# Altium schematic sheet Schematic.SchDoc
size A4
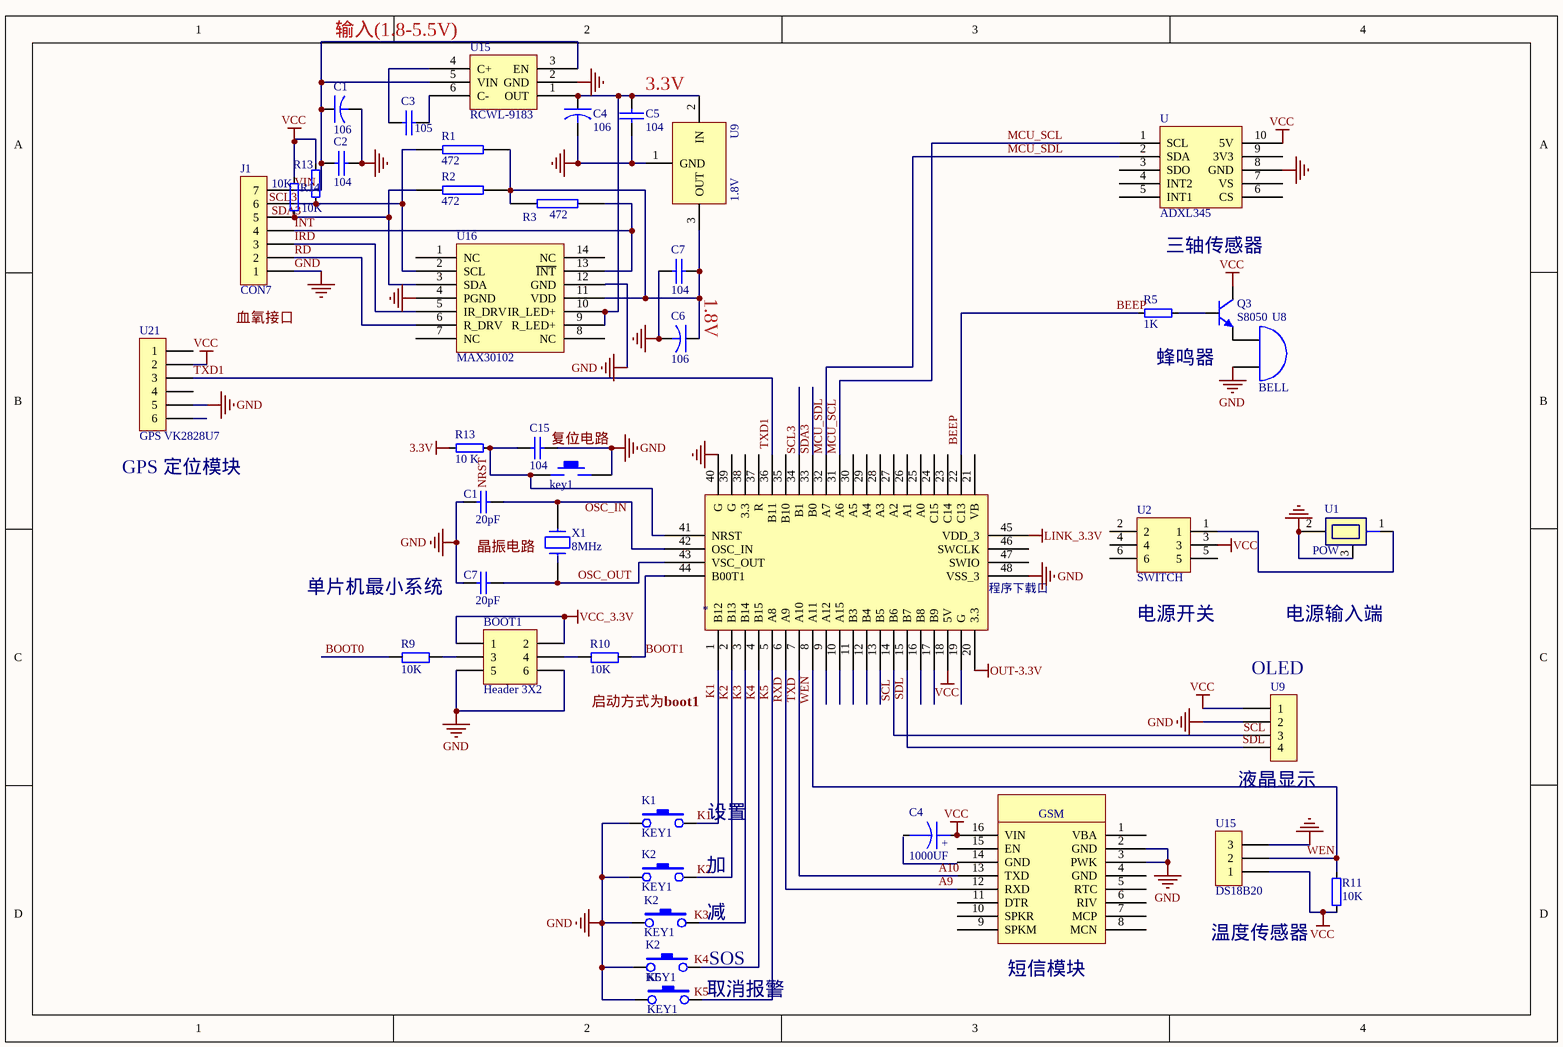
[diagram p0: Schematic.SchDoc]

## Parts
(Parts that share a designator on the sheet are numbered #1, #2 ... from top to bottom, then left to right.)
*  程序下载口
?  (no value)
BOOT1  Header 3X2  [排针2X3]
C1#1  106
C1#2  20pF  [0603C]
C2  104
C3  105
C4#1  106
C4#2  1000UF  [C10]
C5  104
C6  106
C7#1  104
C7#2  20pF  [0603C]
C15  104  [0603C]
J1  CON7
K1  KEY1  [KEY1]
K2#1  KEY1  [KEY1]
K2#2  KEY1  [KEY1]
K2#3  KEY1  [KEY1]
K5  KEY1  [KEY1]
key1  KEY_M  [按键]  (value not drawn)
Q3  S8050  [PNP]
R1  472
R2  472
R3  472
R5  1K  [R-DIP]
R9  10K  [0603R]
R10  10K  [0603R]
R11  10K  [R-DIP]
R13#1  10K  [R-DIP]
R13#2  10 K  [R-DIP]
R14  10K  [R-DIP]
U  ADXL345  [ADXL345]
U1  POW  [DCM]
U2  SWITCH  [KG1]
U8  BELL  [BEEP]
U9#1  1.8V  [TO220H]
U9#2  (no value)  [SIP4]
U15#1  RCWL-9183
U15#2  DS18B20  [SIP3]
U16  MAX30102
U21  GPS VK2828U7  [SIP6]
X1  8MHz  [晶振8M]

## Nets
3.3V: R13#2.1
GND: *.40(G) *.48(VSS_3) ?.2(GND) ?.3(PWK) BOOT1.5 BOOT1.6 C1#1.2 C1#2.1 C2.1 C4#1.2 C5.1 C6.2 C7#1.1 C7#2.1 C15.1 J1.1 K1.1 K2#1.1 K2#2.1 K2#3.1 K5.1 key1.2 U.8(GND) U1.2 U1.3 U8.2(B) U9#1.1(GND) U9#2.2 U15#1.2(GND) U15#2.3 U16.4(PGND) U16.12(GND) U21.5
LINK_3.3V: *.45(VDD_3)
OUT-3.3V: *.20(3.3)
VCC: *.18(5V) ?.16(VIN) C4#2.1 Q3.3(C) R11.1 R13#1.2 R14.2 U.10(5V) U2.3 U9#2.1 U15#2.1 U21.2
VCC_3.3V: BOOT1.1 BOOT1.2
A9: *.6(A9) ?.12(RXD)  [also labelled RXD]
A10: *.7(A10) ?.13(TXD)  [also labelled TXD]
BEEP: *.22(C13) R5.1
BOOT0: R9.1
BOOT1: *.44(B00T1) R10.2
INT: J1.4 R3.2 U16.13(~{INT})
IRD: J1.3 U16.5(IR_DRV)
K1: *.1(B12) K1.2
K2: *.2(B13) K2#1.2
K3: *.3(B14) K2#2.2
K4: *.4(B15) K2#3.2
K5: *.5(A8) K5.2
MCU_SCL: *.31(A6) U.1(SCL)
MCU_SDL: *.32(A7) U.2(SDA)
OSC_OUT: *.43(VSC_OUT) C7#2.2 X1.1
RD: J1.2 U16.6(R_DRV)
SCL: *.14(B6) U9#2.3
SCL3: *.34(B1)
SDA3: *.33(B0)
SDL: *.15(B7) U9#2.4
TXD1: *.36(B11) U21.3
VIN: C1#1.1 C2.2 J1.7 U15#1.3(EN) U15#1.5(VIN)
WEN: *.8(A11) R11.2 U15#2.2
Net*_41: *.41(NRST) C15.2 key1.1 R13#2.2
Net*_42: *.42(OSC_IN) C1#2.2 X1.2
NetBOOT1_3: BOOT1.3 R9.2
NetBOOT1_4: BOOT1.4 R10.1
NetC3_1: C3.1 U15#1.4(C+)
NetC3_2: C3.2 U15#1.6(C-)
NetC4#1_1: C4#1.1 C5.2 U9#1.2(IN) U15#1.1(OUT) U16.9(R_LED+) U16.10(IR_LED+)
NetC6_1: C6.1 C7#1.2 R1.1 R2.1 R3.1 U9#1.3(OUT) U16.11(VDD)
NetJ1_5: J1.5 R2.2 R14.1 U16.3(SDA)
NetJ1_6: J1.6 R1.2 R13#1.1 U16.2(SCL)
NetQ3_1: Q3.1(B) R5.2
NetQ3_2: Q3.2(E) U8.1(A)
NetU1_1: U1.1 U2.1

Not connected (* = marked no-connect by the designer): * 9(A12) 10(A15) 11(B3) 12(B4) 13(B5) 16(B8) 17(B9) 19(G) 21(VB) 23(C14) 24(C15) 25(A0) 26(A1) 27(A2) 28(A3) 29(A4) 30(A5) 35(B10) 37(R) 38(3.3) 39(G) 46(SWCLK) 47(SWIO); ? 1(VBA) 4(GND) 5(RTC) 6(RIV) 7(MCP) 8(MCN) 9(SPKM) 10(SPKR) 11(DTR) 14(GND) 15(EN); C4#2 2; U 3(SDO) 4(INT2) 5(INT1) 6(CS) 7(VS) 9(3V3); U2 2 4 5 6; U16 1(NC) 7(NC) 8(NC) 14(NC); U21 1 4 6

## Notes on the sheet
- (near U15#1) 输入(1.8-5.5V)
- 3.3V
- 三轴传感器
- (near C6) 1.8V
- 蜂鸣器
- (near U21) GPS 定位模块
- 单片机最小系统
- (near U2) 电源开关
- 电源输入端
- (near U9#2) OLED
- (near U9#2) 液晶显示
- (near K1) 设置
- (near K2#1) 加
- (near K2#2) 减
- 取消报警
- (near K2#3) SOS
- 短信模块
- 温度传感器
- Labels drawn without touching a wire or pin: K3, K4, K5, NRST, OSC_IN, SCL3, SDA3, 启动方式为boot1, 复位电路, 晶振电路, 血氧接口
- (in symbol 10uF) +
- (in symbol Component_1) GSM

## Library data of the parts
* = STM32F103C8T6-2
? = Component_1
BOOT1 = Header 3X2: Header, 3-Pin, Dual row; LatestRevisionDate: 17-Jul-2002; LatestRevisionNote: Re-released for DXP Platform.; Publisher: Altium Limited
C1#1 C4#1 C6 = CAPACITOR
C1#2 C7#2 C15 = Cap: Capacitor; Value: 10nF; Published: 8-Jun-2000; Revision: July-2002: Re-released for DXP Platform.; Publisher: Altium Limited
C2 C3 C5 C7#1 = CAP: Capacitor
C4#2 = 10uF
J1 = CON7: Connector
Q3 = NPN
R1-R3 = RES2
R9 R10 = R
R13#2 = 1K
U9#1 = VOLTREG
U9#2 = CON4
U15#2 = CON3
U16 = MAX30100
U21 = CON6
X1 = CRYSTAL